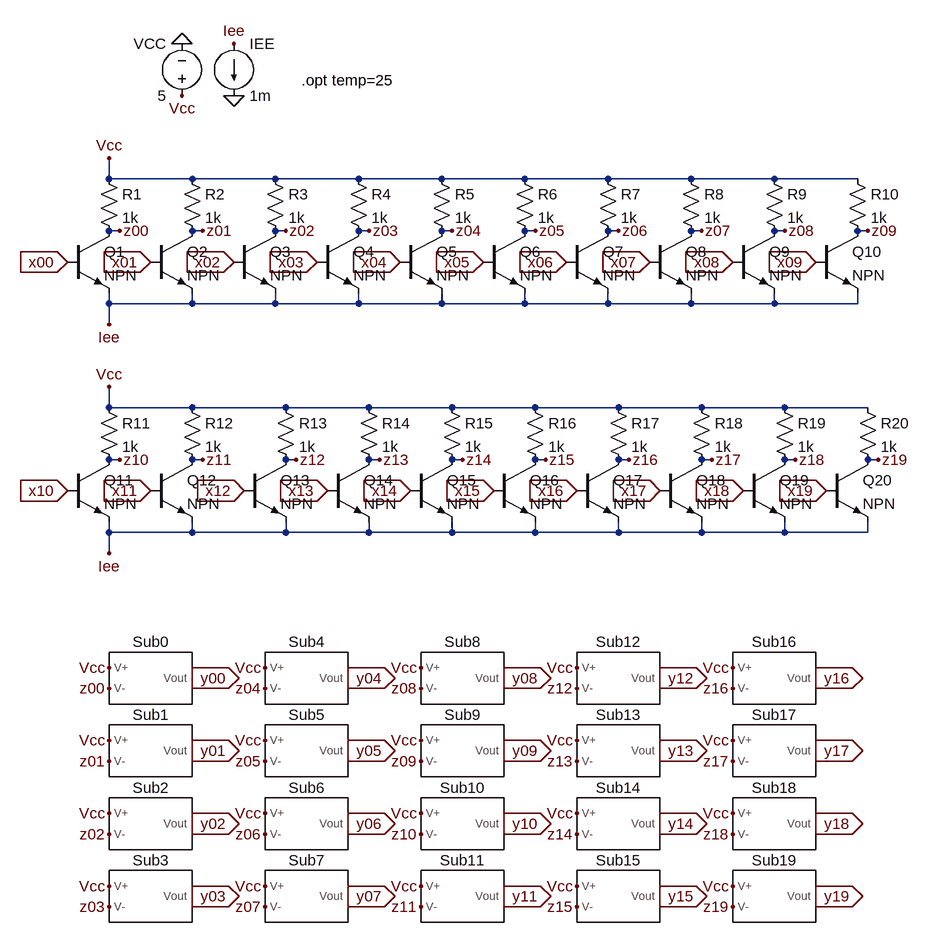
[diagram p0: schematic softmax_20.asc]
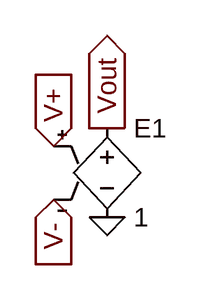
[diagram p1: sub-circuit subtractor.asc]
softmax_20.asc, the LTspice schematic file:
Version 4
SHEET 1 3172 1196
WIRE 144 16 144 -16
WIRE 272 16 144 16
WIRE 400 16 272 16
WIRE 528 16 400 16
WIRE 656 16 528 16
WIRE 784 16 656 16
WIRE 912 16 784 16
WIRE 1040 16 912 16
WIRE 1168 16 1040 16
WIRE 1296 16 1168 16
WIRE 160 96 144 96
WIRE 288 96 272 96
WIRE 416 96 400 96
WIRE 544 96 528 96
WIRE 672 96 656 96
WIRE 800 96 784 96
WIRE 928 96 912 96
WIRE 1056 96 1040 96
WIRE 1184 96 1168 96
WIRE 1312 96 1296 96
WIRE 144 208 144 192
WIRE 272 208 272 192
WIRE 272 208 144 208
WIRE 400 208 400 192
WIRE 400 208 272 208
WIRE 528 208 528 192
WIRE 528 208 400 208
WIRE 656 208 656 192
WIRE 656 208 528 208
WIRE 784 208 784 192
WIRE 784 208 656 208
WIRE 912 208 912 192
WIRE 912 208 784 208
WIRE 1040 208 1040 192
WIRE 1040 208 912 208
WIRE 1168 208 1168 192
WIRE 1168 208 1040 208
WIRE 1296 208 1296 192
WIRE 1296 208 1168 208
WIRE 144 240 144 208
WIRE 144 368 144 336
WIRE 272 368 144 368
WIRE 416 368 272 368
WIRE 544 368 416 368
WIRE 672 368 544 368
WIRE 800 368 672 368
WIRE 928 368 800 368
WIRE 1056 368 928 368
WIRE 1184 368 1056 368
WIRE 1312 368 1184 368
WIRE 160 448 144 448
WIRE 288 448 272 448
WIRE 432 448 416 448
WIRE 560 448 544 448
WIRE 688 448 672 448
WIRE 816 448 800 448
WIRE 944 448 928 448
WIRE 1072 448 1056 448
WIRE 1200 448 1184 448
WIRE 1328 448 1312 448
WIRE 144 560 144 544
WIRE 272 560 272 544
WIRE 272 560 144 560
WIRE 416 560 416 544
WIRE 416 560 272 560
WIRE 544 560 544 544
WIRE 544 560 416 560
WIRE 672 560 672 544
WIRE 672 560 544 560
WIRE 800 560 800 544
WIRE 800 560 672 560
WIRE 928 560 928 544
WIRE 928 560 800 560
WIRE 1056 560 1056 544
WIRE 1056 560 928 560
WIRE 1184 560 1184 544
WIRE 1184 560 1056 560
WIRE 1312 560 1312 544
WIRE 1312 560 1184 560
WIRE 144 592 144 560
FLAG 336 -112 0
FLAG 256 -192 0
FLAG 80 144 x00
IOPIN 80 144 In
FLAG 208 144 x01
IOPIN 208 144 In
FLAG 336 144 x02
IOPIN 336 144 In
FLAG 160 96 z00
FLAG 288 96 z01
FLAG 416 96 z02
FLAG 144 800 z00
FLAG 272 784 y00
IOPIN 272 784 Out
FLAG 464 144 x03
IOPIN 464 144 In
FLAG 592 144 x04
IOPIN 592 144 In
FLAG 720 144 x05
IOPIN 720 144 In
FLAG 544 96 z03
FLAG 672 96 z04
FLAG 800 96 z05
FLAG 848 144 x06
IOPIN 848 144 In
FLAG 976 144 x07
IOPIN 976 144 In
FLAG 1104 144 x08
IOPIN 1104 144 In
FLAG 928 96 z06
FLAG 1056 96 z07
FLAG 1184 96 z08
FLAG 1232 144 x09
IOPIN 1232 144 In
FLAG 80 496 x10
IOPIN 80 496 In
FLAG 208 496 x11
IOPIN 208 496 In
FLAG 1312 96 z09
FLAG 160 448 z10
FLAG 288 448 z11
FLAG 352 496 x12
IOPIN 352 496 In
FLAG 480 496 x13
IOPIN 480 496 In
FLAG 608 496 x14
IOPIN 608 496 In
FLAG 432 448 z12
FLAG 560 448 z13
FLAG 688 448 z14
FLAG 736 496 x15
IOPIN 736 496 In
FLAG 864 496 x16
IOPIN 864 496 In
FLAG 992 496 x17
IOPIN 992 496 In
FLAG 816 448 z15
FLAG 944 448 z16
FLAG 1072 448 z17
FLAG 1120 496 x18
IOPIN 1120 496 In
FLAG 1248 496 x19
IOPIN 1248 496 In
FLAG 1200 448 z18
FLAG 1328 448 z19
FLAG 256 -112 Vcc
FLAG 144 336 Vcc
FLAG 144 -16 Vcc
FLAG 336 -192 Iee
FLAG 144 592 Iee
FLAG 144 240 Iee
FLAG 144 768 Vcc
FLAG 144 912 z01
FLAG 272 896 y01
IOPIN 272 896 Out
FLAG 144 880 Vcc
FLAG 144 1024 z02
FLAG 272 1008 y02
IOPIN 272 1008 Out
FLAG 144 992 Vcc
FLAG 144 1136 z03
FLAG 272 1120 y03
IOPIN 272 1120 Out
FLAG 144 1104 Vcc
FLAG 384 800 z04
FLAG 512 784 y04
IOPIN 512 784 Out
FLAG 384 768 Vcc
FLAG 384 912 z05
FLAG 512 896 y05
IOPIN 512 896 Out
FLAG 384 880 Vcc
FLAG 384 1024 z06
FLAG 512 1008 y06
IOPIN 512 1008 Out
FLAG 384 992 Vcc
FLAG 384 1136 z07
FLAG 512 1120 y07
IOPIN 512 1120 Out
FLAG 384 1104 Vcc
FLAG 624 800 z08
FLAG 752 784 y08
IOPIN 752 784 Out
FLAG 624 768 Vcc
FLAG 624 912 z09
FLAG 752 896 y09
IOPIN 752 896 Out
FLAG 624 880 Vcc
FLAG 624 1024 z10
FLAG 752 1008 y10
IOPIN 752 1008 Out
FLAG 624 992 Vcc
FLAG 624 1136 z11
FLAG 752 1120 y11
IOPIN 752 1120 Out
FLAG 624 1104 Vcc
FLAG 864 800 z12
FLAG 992 784 y12
IOPIN 992 784 Out
FLAG 864 768 Vcc
FLAG 864 912 z13
FLAG 992 896 y13
IOPIN 992 896 Out
FLAG 864 880 Vcc
FLAG 864 1024 z14
FLAG 992 1008 y14
IOPIN 992 1008 Out
FLAG 864 992 Vcc
FLAG 864 1136 z15
FLAG 992 1120 y15
IOPIN 992 1120 Out
FLAG 864 1104 Vcc
FLAG 1104 800 z16
FLAG 1232 784 y16
IOPIN 1232 784 Out
FLAG 1104 768 Vcc
FLAG 1104 912 z17
FLAG 1232 896 y17
IOPIN 1232 896 Out
FLAG 1104 880 Vcc
FLAG 1104 1024 z18
FLAG 1232 1008 y18
IOPIN 1232 1008 Out
FLAG 1104 992 Vcc
FLAG 1104 1136 z19
FLAG 1232 1120 y19
IOPIN 1232 1120 Out
FLAG 1104 1104 Vcc
SYMBOL npn 80 96 R0
SYMATTR InstName Q1
SYMBOL npn 208 96 R0
SYMATTR InstName Q2
SYMBOL npn 336 96 R0
SYMATTR InstName Q3
SYMBOL voltage 256 -96 R180
WINDOW 0 24 96 Left 2
WINDOW 3 24 16 Left 2
WINDOW 123 0 0 Left 0
WINDOW 39 0 0 Left 0
SYMATTR InstName VCC
SYMATTR Value 5
SYMBOL res 128 0 R0
SYMATTR InstName R1
SYMATTR Value 1k
SYMBOL res 256 0 R0
SYMATTR InstName R2
SYMATTR Value 1k
SYMBOL res 384 0 R0
SYMATTR InstName R3
SYMATTR Value 1k
SYMBOL current 336 -192 R0
WINDOW 123 0 0 Left 0
WINDOW 39 0 0 Left 0
SYMATTR InstName IEE
SYMATTR Value 1m
SYMBOL npn 464 96 R0
SYMATTR InstName Q4
SYMBOL npn 592 96 R0
SYMATTR InstName Q5
SYMBOL npn 720 96 R0
SYMATTR InstName Q6
SYMBOL res 512 0 R0
SYMATTR InstName R4
SYMATTR Value 1k
SYMBOL res 640 0 R0
SYMATTR InstName R5
SYMATTR Value 1k
SYMBOL res 768 0 R0
SYMATTR InstName R6
SYMATTR Value 1k
SYMBOL npn 848 96 R0
SYMATTR InstName Q7
SYMBOL npn 976 96 R0
SYMATTR InstName Q8
SYMBOL npn 1104 96 R0
SYMATTR InstName Q9
SYMBOL res 896 0 R0
SYMATTR InstName R7
SYMATTR Value 1k
SYMBOL res 1024 0 R0
SYMATTR InstName R8
SYMATTR Value 1k
SYMBOL res 1152 0 R0
SYMATTR InstName R9
SYMATTR Value 1k
SYMBOL npn 1232 96 R0
SYMATTR InstName Q10
SYMBOL npn 80 448 R0
SYMATTR InstName Q11
SYMBOL npn 208 448 R0
SYMATTR InstName Q12
SYMBOL res 1280 0 R0
SYMATTR InstName R10
SYMATTR Value 1k
SYMBOL res 128 352 R0
SYMATTR InstName R11
SYMATTR Value 1k
SYMBOL res 256 352 R0
SYMATTR InstName R12
SYMATTR Value 1k
SYMBOL npn 352 448 R0
SYMATTR InstName Q13
SYMBOL npn 480 448 R0
SYMATTR InstName Q14
SYMBOL npn 608 448 R0
SYMATTR InstName Q15
SYMBOL res 400 352 R0
SYMATTR InstName R13
SYMATTR Value 1k
SYMBOL res 528 352 R0
SYMATTR InstName R14
SYMATTR Value 1k
SYMBOL res 656 352 R0
SYMATTR InstName R15
SYMATTR Value 1k
SYMBOL npn 736 448 R0
SYMATTR InstName Q16
SYMBOL npn 864 448 R0
SYMATTR InstName Q17
SYMBOL npn 992 448 R0
SYMATTR InstName Q18
SYMBOL res 784 352 R0
SYMATTR InstName R16
SYMATTR Value 1k
SYMBOL res 912 352 R0
SYMATTR InstName R17
SYMATTR Value 1k
SYMBOL res 1040 352 R0
SYMATTR InstName R18
SYMATTR Value 1k
SYMBOL npn 1120 448 R0
SYMATTR InstName Q19
SYMBOL npn 1248 448 R0
SYMATTR InstName Q20
SYMBOL res 1168 352 R0
SYMATTR InstName R19
SYMATTR Value 1k
SYMBOL res 1296 352 R0
SYMATTR InstName R20
SYMATTR Value 1k
SYMBOL subtractor 208 784 R0
SYMATTR InstName Sub0
SYMBOL subtractor 208 896 R0
SYMATTR InstName Sub1
SYMBOL subtractor 208 1008 R0
SYMATTR InstName Sub2
SYMBOL subtractor 208 1120 R0
SYMATTR InstName Sub3
SYMBOL subtractor 448 784 R0
SYMATTR InstName Sub4
SYMBOL subtractor 448 896 R0
SYMATTR InstName Sub5
SYMBOL subtractor 448 1008 R0
SYMATTR InstName Sub6
SYMBOL subtractor 448 1120 R0
SYMATTR InstName Sub7
SYMBOL subtractor 688 784 R0
SYMATTR InstName Sub8
SYMBOL subtractor 688 896 R0
SYMATTR InstName Sub9
SYMBOL subtractor 688 1008 R0
SYMATTR InstName Sub10
SYMBOL subtractor 688 1120 R0
SYMATTR InstName Sub11
SYMBOL subtractor 928 784 R0
SYMATTR InstName Sub12
SYMBOL subtractor 928 896 R0
SYMATTR InstName Sub13
SYMBOL subtractor 928 1008 R0
SYMATTR InstName Sub14
SYMBOL subtractor 928 1120 R0
SYMATTR InstName Sub15
SYMBOL subtractor 1168 784 R0
SYMATTR InstName Sub16
SYMBOL subtractor 1168 896 R0
SYMATTR InstName Sub17
SYMBOL subtractor 1168 1008 R0
SYMATTR InstName Sub18
SYMBOL subtractor 1168 1120 R0
SYMATTR InstName Sub19
TEXT 440 -136 Left 2 !.opt temp=25

subtractor.asc, the sub-circuit schematic file:
Version 4
SHEET 1 880 680
FLAG 304 144 V+
IOPIN 304 144 In
FLAG 304 192 V-
IOPIN 304 192 In
FLAG 352 128 Vout
IOPIN 352 128 Out
FLAG 352 208 0
SYMBOL e 352 112 R0
SYMATTR InstName E1
SYMATTR Value 1

The netlist it stands for:
* softmax_20.asc
Q1 z00 x00 Iee 0 NPN
Q2 z01 x01 Iee 0 NPN
Q3 z02 x02 Iee 0 NPN
VCC Vcc 0 5
R1 Vcc z00 1k
R2 Vcc z01 1k
R3 Vcc z02 1k
IEE Iee 0 1m
Q4 z03 x03 Iee 0 NPN
Q5 z04 x04 Iee 0 NPN
Q6 z05 x05 Iee 0 NPN
R4 Vcc z03 1k
R5 Vcc z04 1k
R6 Vcc z05 1k
Q7 z06 x06 Iee 0 NPN
Q8 z07 x07 Iee 0 NPN
Q9 z08 x08 Iee 0 NPN
R7 Vcc z06 1k
R8 Vcc z07 1k
R9 Vcc z08 1k
Q10 z09 x09 Iee 0 NPN
Q11 z10 x10 Iee 0 NPN
Q12 z11 x11 Iee 0 NPN
R10 Vcc z09 1k
R11 Vcc z10 1k
R12 Vcc z11 1k
Q13 z12 x12 Iee 0 NPN
Q14 z13 x13 Iee 0 NPN
Q15 z14 x14 Iee 0 NPN
R13 Vcc z12 1k
R14 Vcc z13 1k
R15 Vcc z14 1k
Q16 z15 x15 Iee 0 NPN
Q17 z16 x16 Iee 0 NPN
Q18 z17 x17 Iee 0 NPN
R16 Vcc z15 1k
R17 Vcc z16 1k
R18 Vcc z17 1k
Q19 z18 x18 Iee 0 NPN
Q20 z19 x19 Iee 0 NPN
R19 Vcc z18 1k
R20 Vcc z19 1k
XSub0 Vcc z00 y00 subtractor
XSub1 Vcc z01 y01 subtractor
XSub2 Vcc z02 y02 subtractor
XSub3 Vcc z03 y03 subtractor
XSub4 Vcc z04 y04 subtractor
XSub5 Vcc z05 y05 subtractor
XSub6 Vcc z06 y06 subtractor
XSub7 Vcc z07 y07 subtractor
XSub8 Vcc z08 y08 subtractor
XSub9 Vcc z09 y09 subtractor
XSub10 Vcc z10 y10 subtractor
XSub11 Vcc z11 y11 subtractor
XSub12 Vcc z12 y12 subtractor
XSub13 Vcc z13 y13 subtractor
XSub14 Vcc z14 y14 subtractor
XSub15 Vcc z15 y15 subtractor
XSub16 Vcc z16 y16 subtractor
XSub17 Vcc z17 y17 subtractor
XSub18 Vcc z18 y18 subtractor
XSub19 Vcc z19 y19 subtractor

* block symbol definitions
.subckt subtractor V+ V- Vout
E1 Vout 0 V+ V- 1
.ends subtractor

.model NPN NPN
.model PNP PNP
.lib standard.bjt
.opt temp=25
.backanno
.end